# Altium project 2019_PerfUSB_ch340.PrjPCB
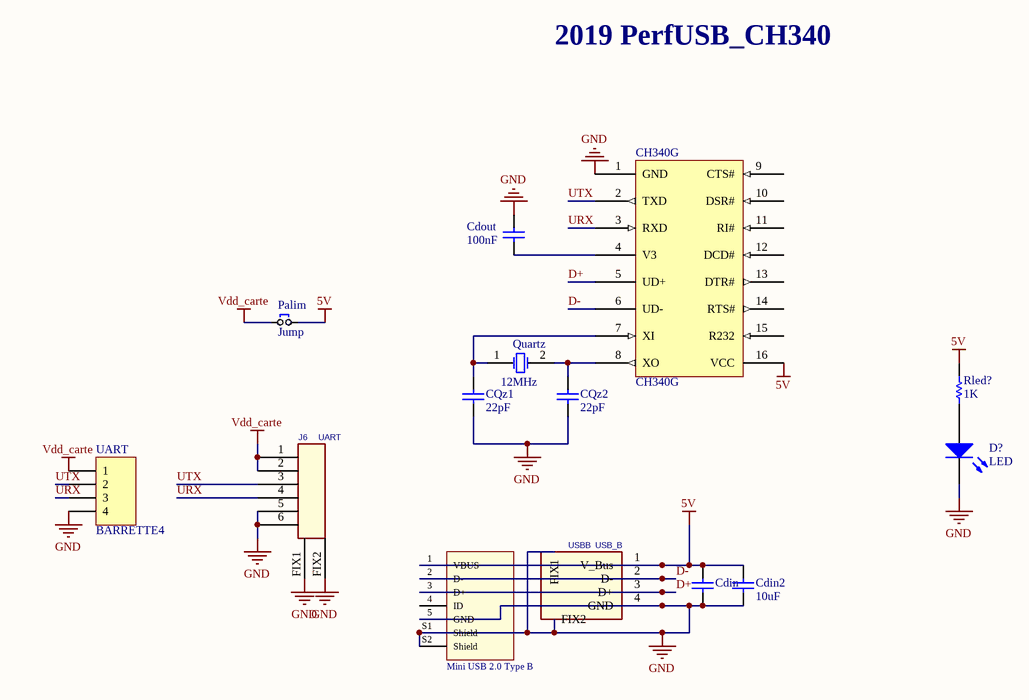
[diagram p0: 2019_PerfUSB_ch340.SchDoc]
1 sheet, 14 parts. Net scope: global (net labels, ports and power ports of the same name join across sheets).
Board file: 2019_PerfUSB_ch340.PcbDoc

## Sheet 2019_PerfUSB_ch340.SchDoc
size A4

### Parts
Cdin  100nF  [C0603_N]  (value not drawn)
Cdin2  10uF  [C1206_N]
Cdout  100nF  [C0603_N]
CH340G  CH340G  [SOP16]
CQz1  22pF  [C0805_N]
CQz2  22pF  [C0805_N]
D?  LED  [LED_0805]
J6  UART  [RJ11_6/6]
J?  Mini USB 2.0 Type B  [USB_MiniB_Horizontal]
Palim  Jump  [HDR1X2]
Quartz  12MHz  [HC49/4H_SMX]
Rled?  1K  [R1206_N]
UART  BARRETTE4  [HDR1X4]
USBB  USB_B  [USB_B_COUDE]

### Nets
5V: Cdin.2 Cdin2.2 CH340G.16(VCC) J?.1(VBUS) Palim.2 Rled?.2 USBB.1(V_Bus)
GND: Cdin.1 Cdin2.1 Cdout.2 CH340G.1(GND) CQz1.1 CQz2.1 D?.2 J6.5 J6.6 J6.FIX1 J6.FIX2 J?.5(GND) J?.S1(Shield) J?.S2(Shield) UART.4 USBB.4(GND) USBB.FIX1 USBB.FIX2
Vdd_carte: J6.1 J6.2 Palim.1 UART.1
D+: CH340G.5(UD+) J?.3(D+) USBB.3(D+)
D-: CH340G.6(UD-) J?.2(D-) USBB.2(D-)
URX: CH340G.3(RXD) J6.4 UART.3
UTX: CH340G.2(TXD) J6.3 UART.2
NetCdout_1: Cdout.1 CH340G.4(V3)
NetCH340G_7: CH340G.7(XI) CQz1.2 Quartz.1(OSC1)
NetCH340G_8: CH340G.8(XO) CQz2.2 Quartz.2(OSC2)
NetD?_1: D?.1 Rled?.1

Not connected (* = marked no-connect by the designer): CH340G 9(CTS#) 10(DSR#) 11(RI#) 12(DCD#) 13(DTR#) 14(RTS#) 15(R232); J? 4(ID)

### Notes on the sheet
- 2019 PerfUSB_CH340

### Library data of the parts
Cdin Cdout = Capacitor: FAR: 1740614; Published: 01/01/10; LatestRevisionDate: 17-Jul-2002; LatestRevisionNote: Re-released for DXP Platform.; Publisher: Damien GUITTON
Cdin2 = Capacitor: Published: 8-Jun-2000; LatestRevisionDate: 17-Jul-2002; LatestRevisionNote: Re-released for DXP Platform.; PackageReference: RAD-0.3; Publisher: Altium Limited
CH340G = CH340G: USB to UART
CQz1 CQz2 = Condensateur: Capacitor; Published: 8-Jun-2000; LatestRevisionDate: 17-Jul-2002; LatestRevisionNote: Re-released for DXP Platform.; PackageReference: RAD-0.3; Publisher: Altium Limited
D? = LED: Typical LED; Published: 8-Jun-2000; LatestRevisionDate: 08-Jul-2005; LatestRevisionNote: Mech Layer 1 removed.; PackageReference: LED-1; Publisher: Altium Limited
J6 = CONNECTEUR_RJ12
J? = USB Mini b: Mini USB 2.0 Type B Vertical THT 5 Contacts WR-COM (ref WURTH : 65100516121); Part Number: 651005136421; Rated Current: 1 A; Gender: Female; ComponentLink1Description: Manufacturer; ComponentLink1URL: http://www.we-online.de; ComponentLink2Description: Datasheet; ComponentLink2URL: http://katalog.we-online.de/em/datasheet/651005136421%282%29.pdf; Published Date: May 2018; Publisher: Wurth Elektronik; Orientation: Vertical; Interface Type: Mini USB 2.0 Type B; Operating Temperature: -40 to 105 degC; Mounting Technology: THT; Packaging: Tray
Palim = Jumper SIP2.54
Quartz = Quartz: Crystal Oscillator; Published: 8-Jun-2000; LatestRevisionDate: 17-Jul-2002; LatestRevisionNote: Re-released for DXP Platform.; PackageReference: R38; Publisher: Altium Limited
Rled? = Resistor: Published: 8-Jun-2000; LatestRevisionDate: 17-Jul-2002; LatestRevisionNote: Re-released for DXP Platform.; PackageReference: AXIAL-0.5; Publisher: Altium Limited
UART = BARRETTE4: Header, 4-Pin; LatestRevisionDate: 17-Jul-2002; LatestRevisionNote: Re-released for DXP Platform.; Publisher: Altium Limited